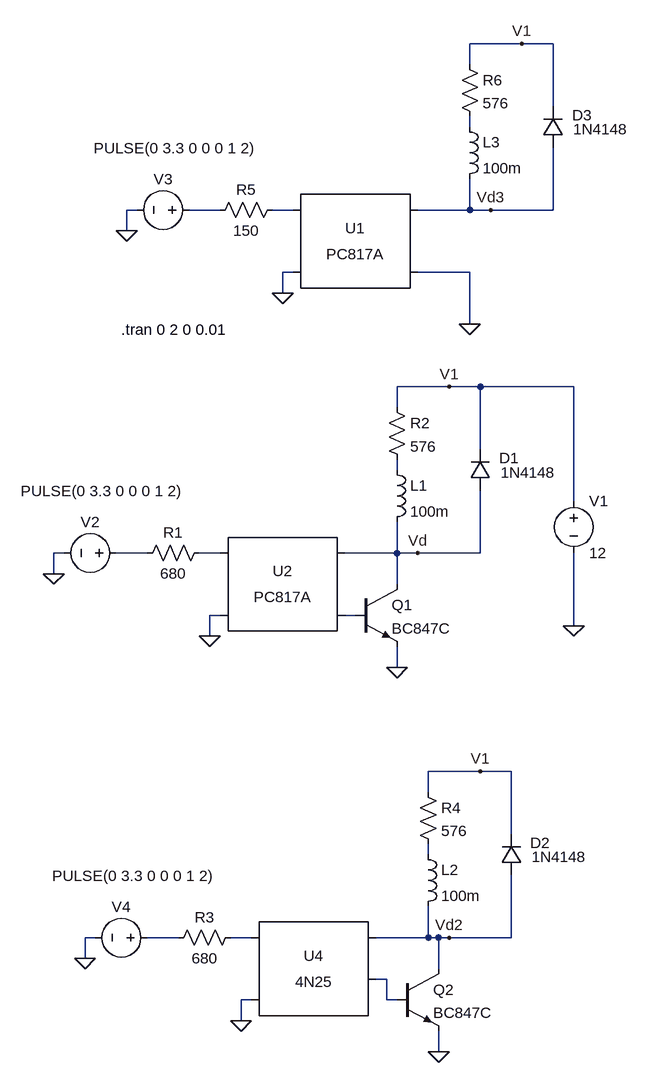
[diagram p0: schematic relay.asc]
relay.asc, the LTspice schematic file:
Version 4.1
SHEET 1 880 1188
WIRE 384 -384 304 -384
WIRE 432 -384 384 -384
WIRE 304 -352 304 -384
WIRE 432 -288 432 -384
WIRE 304 -256 304 -272
WIRE -208 -128 -224 -128
WIRE -80 -128 -128 -128
WIRE 32 -128 0 -128
WIRE 304 -128 304 -176
WIRE 304 -128 224 -128
WIRE 336 -128 304 -128
WIRE 432 -128 432 -224
WIRE 432 -128 336 -128
WIRE -224 -96 -224 -128
WIRE 32 -32 16 -32
WIRE 304 -32 224 -32
WIRE 16 0 16 -32
WIRE 304 48 304 -32
WIRE 272 144 192 144
WIRE 320 144 272 144
WIRE 464 144 320 144
WIRE 192 176 192 144
WIRE 320 240 320 144
WIRE 192 272 192 256
WIRE 464 320 464 144
WIRE -320 400 -336 400
WIRE -192 400 -240 400
WIRE -80 400 -112 400
WIRE 192 400 192 352
WIRE 192 400 112 400
WIRE 224 400 192 400
WIRE 320 400 320 304
WIRE 320 400 224 400
WIRE -336 432 -336 400
WIRE 192 448 192 400
WIRE -80 496 -96 496
WIRE 128 496 112 496
WIRE 464 512 464 400
WIRE -96 528 -96 496
WIRE 192 576 192 544
WIRE 320 736 240 736
WIRE 368 736 320 736
WIRE 240 768 240 736
WIRE 368 832 368 736
WIRE 240 864 240 848
WIRE -272 992 -288 992
WIRE -144 992 -192 992
WIRE -32 992 -64 992
WIRE 240 992 240 944
WIRE 240 992 160 992
WIRE 256 992 240 992
WIRE 272 992 256 992
WIRE 368 992 368 896
WIRE 368 992 272 992
WIRE -288 1024 -288 992
WIRE 256 1040 256 992
WIRE 176 1056 160 1056
WIRE -32 1088 -48 1088
WIRE 176 1088 176 1056
WIRE 192 1088 176 1088
WIRE -48 1120 -48 1088
WIRE 256 1168 256 1136
FLAG -96 528 0
FLAG 464 512 0
FLAG -336 432 0
FLAG 224 400 Vd
FLAG 272 144 V1
FLAG 192 576 0
FLAG -48 1120 0
FLAG -288 1024 0
FLAG 272 992 Vd2
FLAG 320 736 V1
FLAG 256 1168 0
FLAG 16 0 0
FLAG -224 -96 0
FLAG 336 -128 Vd3
FLAG 384 -384 V1
FLAG 304 48 0
SYMBOL res -96 384 R90
WINDOW 0 0 56 VBottom 2
WINDOW 3 32 56 VTop 2
SYMATTR InstName R1
SYMATTR Value 680
SYMBOL ind 176 256 R0
SYMATTR InstName L1
SYMATTR Value 100m
SYMBOL res 176 160 R0
SYMATTR InstName R2
SYMATTR Value 576
SYMBOL diode 336 304 R180
WINDOW 0 -44 50 Left 2
WINDOW 3 -100 28 Left 2
SYMATTR InstName D1
SYMATTR Value 1N4148
SYMBOL voltage 464 304 R0
WINDOW 123 0 0 Left 0
WINDOW 39 0 0 Left 0
SYMATTR InstName V1
SYMATTR Value 12
SYMBOL voltage -224 400 R90
WINDOW 0 -32 56 VBottom 2
WINDOW 3 -111 38 VTop 2
WINDOW 123 0 0 Left 0
WINDOW 39 0 0 Left 0
SYMATTR InstName V2
SYMATTR Value PULSE(0 3.3 0 0 0 1 2)
SYMBOL Optos\\PC817A 16 448 R0
SYMATTR InstName U2
SYMBOL npn 128 448 R0
SYMATTR InstName Q1
SYMATTR Value BC847C
SYMBOL res -48 976 R90
WINDOW 0 0 56 VBottom 2
WINDOW 3 32 56 VTop 2
SYMATTR InstName R3
SYMATTR Value 680
SYMBOL ind 224 848 R0
SYMATTR InstName L2
SYMATTR Value 100m
SYMBOL res 224 752 R0
SYMATTR InstName R4
SYMATTR Value 576
SYMBOL diode 384 896 R180
WINDOW 0 -44 50 Left 2
WINDOW 3 -100 28 Left 2
SYMATTR InstName D2
SYMATTR Value 1N4148
SYMBOL voltage -176 992 R90
WINDOW 0 -32 56 VBottom 2
WINDOW 3 -111 38 VTop 2
WINDOW 123 0 0 Left 0
WINDOW 39 0 0 Left 0
SYMATTR InstName V4
SYMATTR Value PULSE(0 3.3 0 0 0 1 2)
SYMBOL npn 192 1040 R0
SYMATTR InstName Q2
SYMATTR Value BC847C
SYMBOL Optos\\4N25 64 1056 R0
SYMATTR InstName U4
SYMBOL res 16 -144 R90
WINDOW 0 0 56 VBottom 2
WINDOW 3 32 56 VTop 2
SYMATTR InstName R5
SYMATTR Value 150
SYMBOL ind 288 -272 R0
SYMATTR InstName L3
SYMATTR Value 100m
SYMBOL res 288 -368 R0
SYMATTR InstName R6
SYMATTR Value 576
SYMBOL diode 448 -224 R180
WINDOW 0 -44 50 Left 2
WINDOW 3 -100 28 Left 2
SYMATTR InstName D3
SYMATTR Value 1N4148
SYMBOL voltage -112 -128 R90
WINDOW 0 -32 56 VBottom 2
WINDOW 3 -111 38 VTop 2
WINDOW 123 0 0 Left 0
WINDOW 39 0 0 Left 0
SYMATTR InstName V3
SYMATTR Value PULSE(0 3.3 0 0 0 1 2)
SYMBOL Optos\\PC817A 128 -80 R0
SYMATTR InstName U1
TEXT -232 56 Left 2 !.tran 0 2 0 0.01

The netlist it stands for:
* relay.asc
R1 N006 N005 680
L1 N004 Vd 100m
R2 V1 N004 576
D1 Vd V1 1N4148
V1 V1 0 12
V2 N005 0 PULSE(0 3.3 0 0 0 1 2)
X§U2 N006 0 Vd N007 PC817 Igain=1m
Q1 Vd N007 0 0 BC847C
R3 N010 N009 680
L2 N008 Vd2 100m
R4 V1 N008 576
D2 Vd2 V1 1N4148
V4 N009 0 PULSE(0 3.3 0 0 0 1 2)
Q2 Vd2 N011 0 0 BC847C
X§U4 N010 0 Vd2 N011 NC_01 4N25
R5 N003 N002 150
L3 N001 Vd3 100m
R6 V1 N001 576
D3 Vd3 V1 1N4148
V3 N002 0 PULSE(0 3.3 0 0 0 1 2)
X§U1 N003 0 Vd3 0 PC817 Igain=1m
.model D D
.lib standard.dio
.model NPN NPN
.model PNP PNP
.lib standard.bjt
.tran 0 2 0 0.01
.lib PC817.sub
.lib 4N25.sub
.backanno
.end